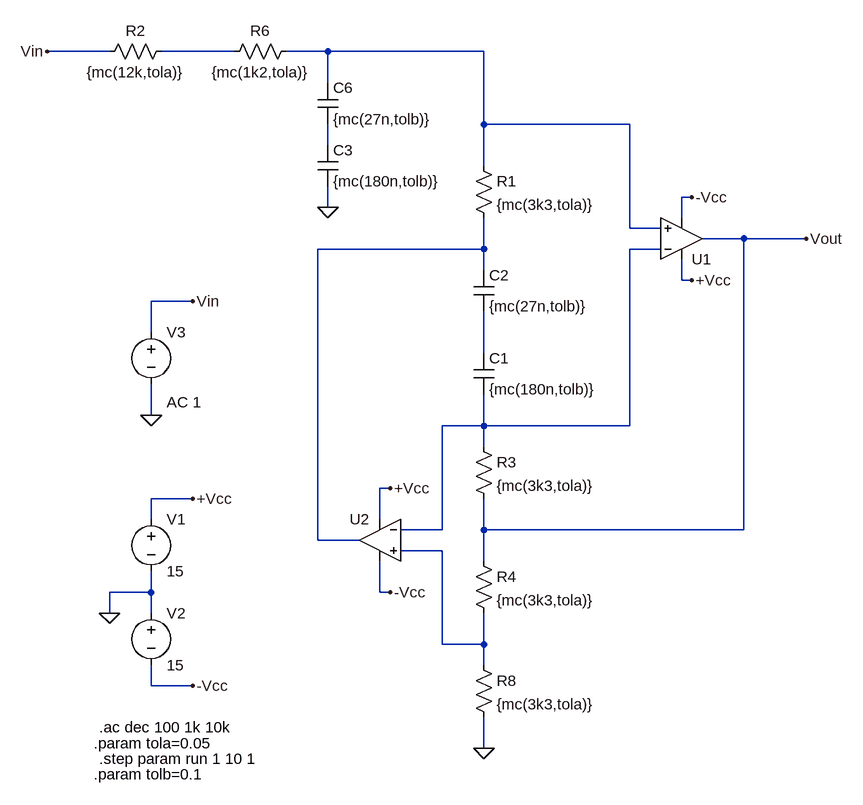
[diagram p0: schematic Simulacion_TP3_parte1.asc]
Simulacion_TP3_parte1.asc, the LTspice schematic file:
Version 4
SHEET 1 1264 928
WIRE -336 -224 -432 -224
WIRE -144 -224 -256 -224
WIRE 0 -224 -64 -224
WIRE 240 -224 0 -224
WIRE 0 -176 0 -224
WIRE 240 -112 240 -224
WIRE 464 -112 240 -112
WIRE 0 -80 0 -112
WIRE 240 -48 240 -112
WIRE 560 0 544 0
WIRE 0 16 0 -16
WIRE 544 32 544 0
WIRE 464 48 464 -112
WIRE 512 48 464 48
WIRE 640 64 576 64
WIRE 736 64 640 64
WIRE 240 80 240 32
WIRE 240 80 -16 80
WIRE 512 80 464 80
WIRE 240 112 240 80
WIRE 544 128 544 96
WIRE 560 128 544 128
WIRE -208 160 -272 160
WIRE -272 208 -272 160
WIRE 240 240 240 176
WIRE -272 336 -272 288
WIRE 240 352 240 304
WIRE 240 352 176 352
WIRE 464 352 464 80
WIRE 464 352 240 352
WIRE 240 384 240 352
WIRE 96 448 80 448
WIRE -208 464 -272 464
WIRE -272 496 -272 464
WIRE 80 496 80 448
WIRE 176 512 176 352
WIRE 176 512 112 512
WIRE 240 512 240 464
WIRE 640 512 640 64
WIRE 640 512 240 512
WIRE -16 528 -16 80
WIRE 48 528 -16 528
WIRE 176 544 112 544
WIRE 240 560 240 512
WIRE -272 608 -272 576
WIRE -272 608 -336 608
WIRE 80 608 80 560
WIRE 96 608 80 608
WIRE -336 640 -336 608
WIRE -272 640 -272 608
WIRE 176 688 176 544
WIRE 240 688 240 640
WIRE 240 688 176 688
WIRE 240 720 240 688
WIRE -272 752 -272 720
WIRE -208 752 -272 752
WIRE 240 848 240 800
FLAG 240 848 0
FLAG -336 640 0
FLAG -208 752 -Vcc
FLAG -208 464 +Vcc
FLAG 736 64 Vout
FLAG -272 336 0
FLAG -208 160 Vin
FLAG 560 128 +Vcc
FLAG 96 448 +Vcc
FLAG 560 0 -Vcc
FLAG 96 608 -Vcc
FLAG -432 -224 Vin
FLAG 0 16 0
SYMBOL res 224 -64 R0
SYMATTR InstName R1
SYMATTR Value {mc(3k3,tola)}
SYMBOL cap 224 112 R0
SYMATTR InstName C2
SYMATTR Value {mc(27n,tolb)}
SYMBOL res 224 368 R0
SYMATTR InstName R3
SYMATTR Value {mc(3k3,tola)}
SYMBOL res 224 544 R0
SYMATTR InstName R4
SYMATTR Value {mc(3k3,tola)}
SYMBOL res 224 704 R0
SYMATTR InstName R8
SYMATTR Value {mc(3k3,tola)}
SYMBOL voltage -272 480 R0
WINDOW 123 0 0 Left 0
WINDOW 39 0 0 Left 0
SYMATTR InstName V1
SYMATTR Value 15
SYMBOL voltage -272 624 R0
WINDOW 123 0 0 Left 0
WINDOW 39 0 0 Left 0
SYMATTR InstName V2
SYMATTR Value 15
SYMBOL cap -16 -176 R0
SYMATTR InstName C6
SYMATTR Value {mc(27n,tolb)}
SYMBOL voltage -272 192 R0
WINDOW 123 24 124 Left 2
WINDOW 39 0 0 Left 0
SYMATTR Value2 AC 1
SYMATTR InstName V3
SYMATTR Value ""
SYMBOL res -48 -240 R90
WINDOW 0 0 56 VBottom 2
WINDOW 3 32 56 VTop 2
SYMATTR InstName R6
SYMATTR Value {mc(1k2,tola)}
SYMBOL Opamps\\UniversalOpamp2 544 64 M180
SYMATTR InstName U1
SYMBOL Opamps\\UniversalOpamp2 80 528 M0
SYMATTR InstName U2
SYMBOL cap 224 240 R0
SYMATTR InstName C1
SYMATTR Value {mc(180n,tolb)}
SYMBOL res -240 -240 R90
WINDOW 0 0 56 VBottom 2
WINDOW 3 32 56 VTop 2
SYMATTR InstName R2
SYMATTR Value {mc(12k,tola)}
SYMBOL cap -16 -80 R0
SYMATTR InstName C3
SYMATTR Value {mc(180n,tolb)}
TEXT -360 840 Left 2 !.param tola=0.05
TEXT -360 888 Left 2 !.param tolb=0.1
TEXT -352 816 Left 2 !.ac dec 100 1k 10k
TEXT -352 864 Left 2 !.step param run 1 10 1

The netlist it stands for:
* Simulacion_TP3_parte1.asc
R1 N002 N004 {mc(3k3,tola)}
C2 N004 N006 {mc(27n,tolb)}
R3 N005 Vout {mc(3k3,tola)}
R4 Vout N007 {mc(3k3,tola)}
R8 N007 0 {mc(3k3,tola)}
V1 +Vcc 0 15
V2 0 -Vcc 15
C6 N002 N003 {mc(27n,tolb)}
V3 Vin 0 AC 1
R6 N002 N001 {mc(1k2,tola)}
XU1 N002 N005 +Vcc -Vcc Vout level.2 Avol=1Meg GBW=10Meg Slew=10Meg ilimit=25m rail=0 Vos=0 phimargin=45 en=0 enk=0 in=0 ink=0 Rin=500Meg  ; pins IN+ IN- V+ V- OUT
XU2 N007 N005 +Vcc -Vcc N004 level.2 Avol=1Meg GBW=10Meg Slew=10Meg ilimit=25m rail=0 Vos=0 phimargin=45 en=0 enk=0 in=0 ink=0 Rin=500Meg  ; pins IN+ IN- V+ V- OUT
C1 N006 N005 {mc(180n,tolb)}
R2 N001 Vin {mc(12k,tola)}
C3 N003 0 {mc(180n,tolb)}
.param tola=0.05
.param tolb=0.1
.ac dec 100 1k 10k
.step param run 1 10 1
.lib UniversalOpamps2.sub
.backanno
.end